# EAGLE design mcp2200 (EAGLE 5.11)
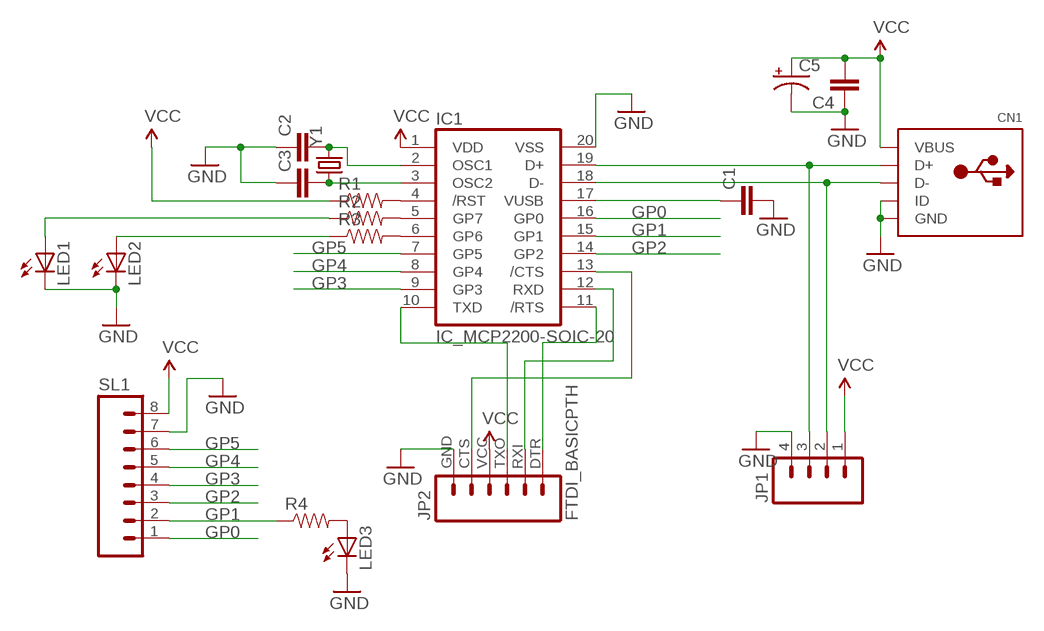
[diagram p0: schematic, sheet 1]

## Parts
C1  CAP0805  [0805]
C2  CAP0805  [0805]
C3  CAP0805  [0805]
C4  CAP0805  [0805]
C5  CAP_POLPTH1  [CPOL-RADIAL-100UF-25V]
CN1  USBMINIBLARGE  [USB-MINIB_LARGER]
IC1  IC_MCP2200-SOIC-20  [SOIC-20]
JP1  M04LONGPADS  [1X04_LONGPADS]
JP2  FTDI_BASICPTH  [FTDI_BASIC]
LED1  LED-0805  [LED-805]
LED2  LED-0805  [LED-805]
LED3  LED-0805  [LED-805]
R1  RESISTOR0805-RES  [0805]
R2  RESISTOR0805-RES  [0805]
R3  RESISTOR0805-RES  [0805]
R4  RESISTOR0805-RES  [0805]
SL1  M08  [08P]
Y1  CRYSTALHC49US  [HC49US]

## Nets
D+: CN1.D+ IC1.19(D+) JP1.3
D-: CN1.D- IC1.18(D-) JP1.2
GND: C1.2 C2.1 C3.1 C4.1 C5.2(-) CN1.GND CN1.ID IC1.20(VSS) JP1.4 JP2.GND LED1.C LED2.C LED3.C SL1.7
GP0: IC1.16(GP0) SL1.1
GP1: IC1.15(GP1) R4.1 SL1.2
GP2: IC1.14(GP2) SL1.3
GP3: IC1.9(GP3) SL1.4
GP4: IC1.8(GP4) SL1.5
GP5: IC1.7(GP5) SL1.6
N$1: C1.1 IC1.17(VUSB)
N$2: IC1.4(/RST) R1.2
N$3: C3.2 IC1.3(OSC2) Y1.1
N$4: C2.2 IC1.2(OSC1) Y1.2
N$7: IC1.12(RXD) JP2.RXI
N$8: IC1.10(TXD) JP2.TXO
N$9: IC1.13(/CTS) JP2.CTS
N$10: IC1.11(/RTS) JP2.DTR
N$11: IC1.5(GP7) R2.2
N$12: IC1.6(GP6) R3.2
N$14: LED1.A R2.1
N$15: LED2.A R3.1
N$23: LED3.A R4.2
VCC: C4.2 C5.1(+) CN1.VBUS IC1.1(VDD) JP1.1 JP2.VCC R1.1 SL1.8

## Library data of the parts
C1-C4 = SparkFun:CAP: Capacitor Standard 0603 ceramic capacitor, and 0.1" leaded capacitor.
C5 = SparkFun:CAP_POL: Capacitor Polarized These are standard SMD and PTH capacitors. Normally 10uF, 47uF, and 100uF in electrolytic and tantalum varieties. Always verify the external diameter of the through hole cap, it varies with capacity, voltage, and manufacturer. The EIA devices should be standard.
CN1 = microbuilder:USB: USB Connectors USBMINIB - Surface Mount Female Mini-B USB Connector 4UConnector: 06564
IC1 = dp_devices:IC_MCP2200
JP1 = SparkFun:M04: Header 4 Standard 4-pin 0.1" header. Use with straight break away headers (SKU : PRT-00116), right angle break away headers (PRT-00553), swiss pins (PRT-00743), machine pins (PRT-00117), and female headers (PRT-00115). Molex polarized connector foot print use with SKU : PRT-08231 with associated crimp pins and housings. 1MM SMD Version SKU: PRT-10208
JP2 = SparkFun:FTDI_BASIC: FTDI Basic: 3.3V and 5V
LED1-LED3 = dp_devices:LED: Light Emitting Diode
R1-R4 = SparkFun:RESISTOR: Resistor Basic schematic elements and footprints for 0603, 1206, and PTH resistors.
SL1 = con-amp-quick:M08: AMP QUICK CONNECTOR; OC_FARNELL: unknown; OC_NEWARK: unknown
Y1 = SparkFun:CRYSTAL: Crystals Various standard crystals. Proven footprints. Spark Fun Electronics SKU : COM-00534

## Board
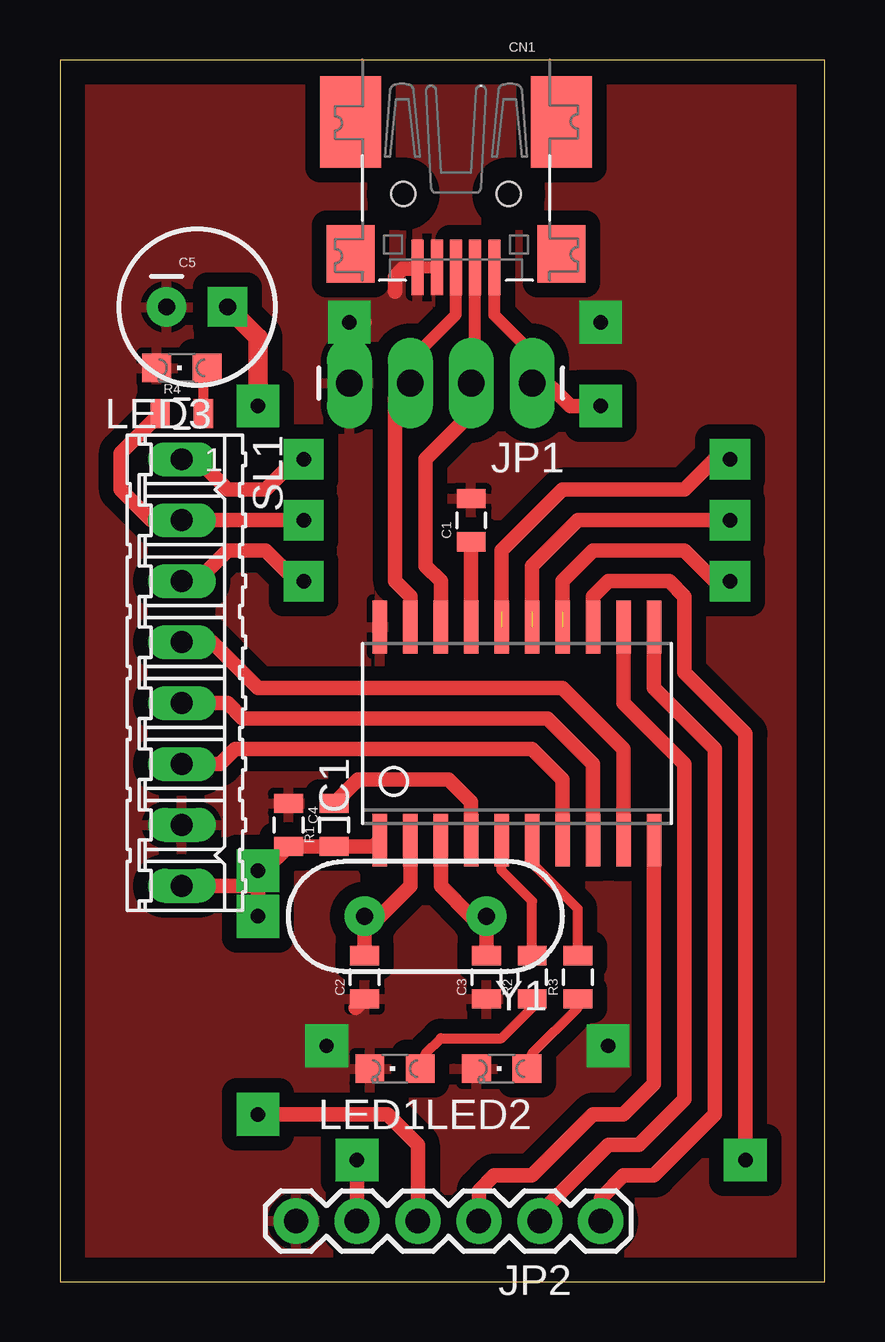
[diagram p1: board, top side]
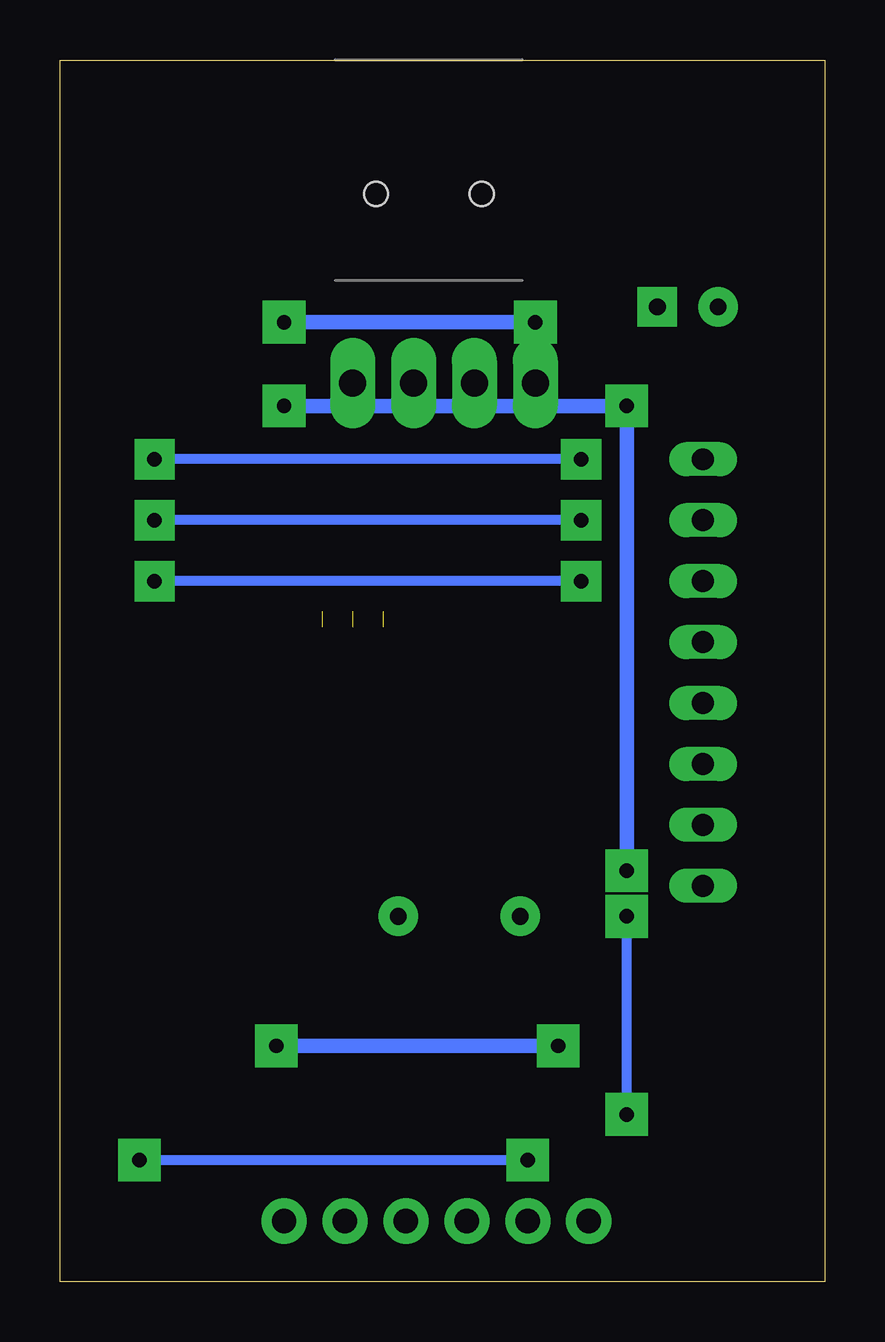
[diagram p2: board, bottom side, seen from below]

Size 31.89 x 50.94 mm. Coordinates in mm from the lower left corner, seen from the top.
Outline: 0,0 31.89,0 31.89,50.94 0,50.94 0,0
Copper layers (1*16): Top 0.035mm / dielectric 1.5mm / Bottom 0.035mm
Design rules "default": minimum track width 10mil, minimum drill 24mil, track to track 8mil, track to pad 8mil, pad to pad 8mil, via to via 8mil, smd to smd 8mil, copper to edge 40mil, drill to drill 8mil, minimum pad ring 10mil, minimum via ring 8mil, stop-mask expansion 4mil, vias tented up to drill 0mil, thermal gap 10mil

### Footprints (pad centres in the part's own frame; a part is rotated, then mirrored left to right if it is on the bottom)
0805 = smd 0.8 x 1.2: 1 -0.9,0; 2 0.9,0
CPOL-RADIAL-100UF-25V = drill 0.7 pad 1.651 square: 1 1.27,0 | drill 0.7 pad 1.651 round: 2 -1.27,0
USB-MINIB_LARGER = smd 0.5 x 2.308: D+ 0,4.064; D- -0.8,4.064; GND 1.6,4.064; ID 0.8,4.064; VBUS -1.6,4.064 | smd 2.54 x 3.81: GND1 -4.4,-2; GND4 4.4,-2 | smd 2 x 2.4: GND2 -4.4,3.5; GND3 4.4,3.5 | hole 1: -2.2,1; 2.2,1
SOIC-20 = smd 0.6 x 2.2: 1 -5.715,-4.445; 2 -4.445,-4.445; 3 -3.175,-4.445; 4 -1.905,-4.445; 5 -0.635,-4.445; 6 0.635,-4.445; 7 1.905,-4.445; 8 3.175,-4.445; 9 4.445,-4.445; 10 5.715,-4.445; 11 5.715,4.445; 12 4.445,4.445; 13 3.175,4.445; 14 1.905,4.445; 15 0.635,4.445; 16 -0.635,4.445; 17 -1.905,4.445; 18 -3.175,4.445; 19 -4.445,4.445; 20 -5.715,4.445
1X04_LONGPADS = drill 1.118 pad 1.88 long: 1 0,0; 2 2.54,0; 3 5.08,0; 4 7.62,0
FTDI_BASIC = drill 1.016 pad 1.88 round: CTS 10.16,0; DTR 0,0; GND 12.7,0; RXI 2.54,0; TXO 5.08,0; VCC 7.62,0
LED-805 = smd 1.2 x 1.2: A 0,-1.05; C 0,1.05
08P = drill 0.914 long: 1 -8.89,0; 2 -6.35,0; 3 -3.81,0; 4 -1.27,0; 5 1.27,0; 6 3.81,0; 7 6.35,0; 8 8.89,0
HC49US = drill 0.7 pad 1.651 round: 1 -2.54,0; 2 2.54,0

### Placement (x,y rotation side)
C1  17.14,31.75 90 top
C2  12.7,12.7 90 top
C3  17.78,12.7 90 top
C4  9.53,19.05 270 top
C5  5.71,40.64 0 top
CN1  16.51,46.35 180 top
IC1  19.05,22.86 0 top
JP1  19.68,37.47 180 top
JP2  22.54,2.54 180 top
LED1  13.97,8.89 90 top
LED2  18.41,8.89 90 top
LED3  5.08,38.1 90 top
R1  11.43,19.05 90 top
R2  19.68,12.7 90 top
R3  21.59,12.7 90 top
R4  5.08,36.2 0 top
SL1  5.08,25.4 270 top
Y1  15.24,15.24 180 top

### Tracks (layer width: path | path; a pad name or v marks a point on that pad's centre or on a via)
D+
  Top 0.508: CN1.D+ 16.51,40.32 14.61,38.42 JP1.3
  Top 0.61: IC1.19 14.61,28.57 13.97,29.21 13.97,36.83 JP1.3
D-
  Top 0.508: CN1.D- 17.31,37.63 JP1.2
  Top 0.61: JP1.2 17.14,36.2 15.24,34.29 15.24,29.84 15.88,29.21 IC1.18
GND  (via drill 0.6 pad 1.78)
  Top 0.508: CN1.GND CN1.ID
  Top 0.61: JP1.4 v12.06,40.01 12.7,40.01 | 13.97,41.27 13.97,41.91 14.29,42.23 14.85,42.23 CN1.GND | 12.33,11.43 C2.1
  Bottom 0.61: v12.06,40.01 v22.54,40.01 | v11.11,9.84 v22.86,9.84
  pour Top (isolate 0.61): 1.27,50.16 30.48,50.16 30.48,0.64 1.27,0.95
GP0  (via drill 0.6 pad 1.68)  (1 unrouted)
  Top 0.61: 18.41,27.94 18.41,30.48 20.95,33.02 26.04,33.02 27.3,34.29 v27.94,34.29 | SL1.1 5.71,34.29 6.99,33.02 8.57,33.02 9.84,34.29 v10.16,34.29
  Bottom 0.406: v10.16,34.29 v27.94,34.29
GP1  (via drill 0.6 pad 1.68)  (1 unrouted)
  Top 0.61: 19.68,27.94 19.68,29.84 21.59,31.75 v27.94,31.75 | v10.16,31.75 SL1.2 3.81,31.75 2.54,33.02 2.54,34.55 R4.1
  Bottom 0.406: v10.16,31.75 v27.94,31.75
GP2  (via drill 0.6 pad 1.68)  (1 unrouted)
  Top 0.61: 20.95,27.94 20.95,29.21 22.23,30.48 26.04,30.48 27.3,29.21 v27.94,29.21 | v10.16,29.21 9.84,29.21 8.57,30.48 6.99,30.48 5.71,29.21 SL1.3
  Bottom 0.406: v10.16,29.21 v27.94,29.21
GP3
  Top 0.61: IC1.9 23.5,22.23 20.95,24.77 8.26,24.77 6.35,26.67 SL1.4
GP4
  Top 0.61: IC1.8 22.23,21.59 20.32,23.5 7.62,23.5 6.99,24.13 SL1.5
GP5
  Top 0.61: IC1.7 20.95,20.95 19.68,22.23 7.3,22.23 6.67,21.59 SL1.6
N$1
  Top 0.61: IC1.17 C1.1
N$2
  Top 0.61: IC1.4 17.14,20 16.19,20.95 12.44,20.95 R1.2
N$3
  Top 0.61: IC1.3 15.88,16.51 17.14,15.24 Y1.1 C3.2
N$4
  Top 0.61: IC1.2 14.61,16.51 13.34,15.24 Y1.2 C2.2
N$7
  Top 0.61: IC1.12 23.5,24.13 26.04,21.59 26.04,7.62 24.13,5.71 22.86,5.71 20.32,3.17 20.32,2.86 JP2.RXI
N$8
  Top 0.61: IC1.10 24.77,8.26 23.5,6.99 22.23,6.99 19.68,4.45 18.1,4.45 17.46,3.81 JP2.TXO
N$9  (via drill 0.6 pad 1.78)
  Top 0.61: IC1.13 22.23,28.57 22.86,29.21 25.4,29.21 26.04,28.57 26.04,25.4 28.57,22.86 v28.57,5.08 | JP2.CTS v12.38,5.08
  Bottom 0.406: v12.38,5.08 v28.57,5.08
N$10
  Top 0.61: IC1.11 24.77,24.77 27.3,22.23 27.3,6.99 24.77,4.45 23.5,4.45 22.54,3.49 JP2.DTR
N$11
  Top 0.406: IC1.5 18.41,17.14 19.68,15.88 R2.2
N$12
  Top 0.406: IC1.6 19.68,17.46 21.59,15.56 R3.2
N$14
  Top 0.406: R2.1 19.68,11.43 18.41,10.16 15.88,10.16 15.24,9.53 15.24,9.11 LED1.A
N$15
  Top 0.406: R3.1 21.59,11.43 19.68,9.53 19.68,9.11 LED2.A
N$23
  Top 0.406: R4.2 5.98,37.95 LED3.A
VCC  (via drill 0.6 pad 1.78)
  Top 0.508: CN1.VBUS 18.11,40.31 19.68,38.73 19.68,38.1 JP1.1
  Top 0.61: IC1.1 13.07,18.15 R1.1 C4.2 8.52,17.14 v8.26,17.14 8.26,16.51 | JP2.VCC 14.92,5.71 13.65,6.99 v8.26,6.99 | v8.26,15.24 8.26,16.51 | 8.26,16.51 SL1.8 | v22.54,36.51 21.27,36.51 19.68,38.1
  Top 0.813: C5.1 8.26,39.37 v8.26,36.51
  Bottom 0.406: v8.26,6.99 v8.26,15.24
  Bottom 0.61: v8.26,17.14 v8.26,36.51 v22.54,36.51